# EAGLE schematic l1_pcb_v38 (EAGLE 9.7.0)

## Sheet 1 of 5
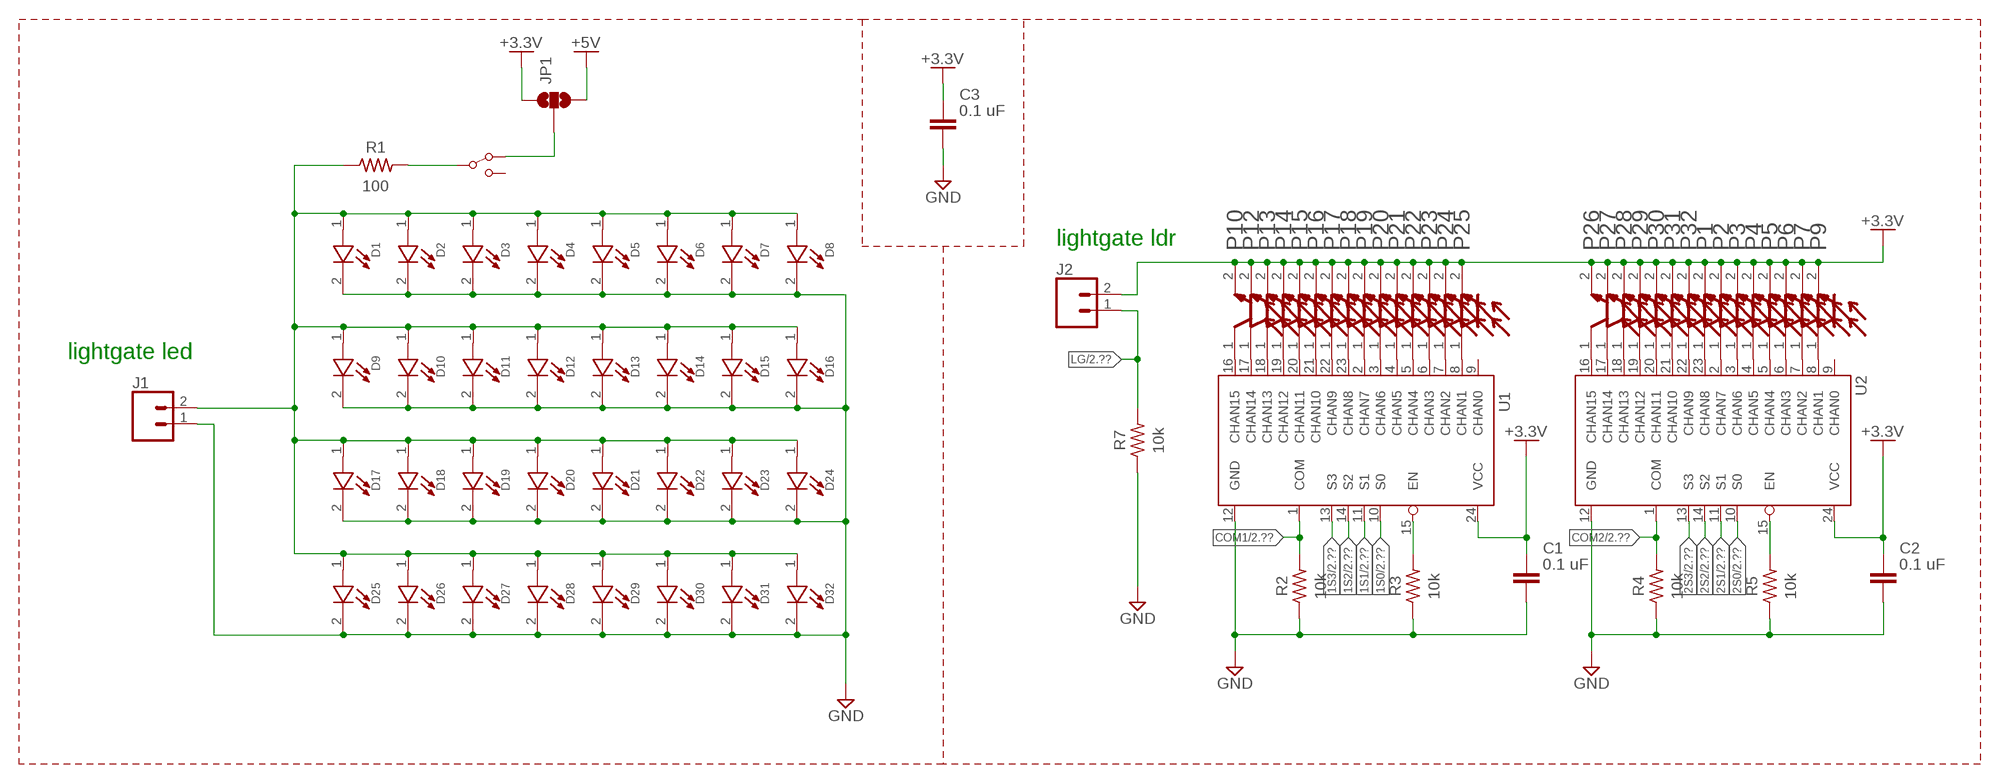
[diagram p0: schematic, sheet 1]

### Parts
C1  0.1 uF  C_CHIP-0603(1608-METRIC)  [CAPC1608X85]
C2  0.1 uF  C_CHIP-0603(1608-METRIC)  [CAPC1608X85]
C3  0.1 uF  C_CHIP-0603(1608-METRIC)  [CAPC1608X85]
D1  OF-SMD3528WCLED  [LED]
D2  OF-SMD3528WCLED  [LED]
D3  OF-SMD3528WCLED  [LED]
D4  OF-SMD3528WCLED  [LED]
D5  OF-SMD3528WCLED  [LED]
D6  OF-SMD3528WCLED  [LED]
D7  OF-SMD3528WCLED  [LED]
D8  OF-SMD3528WCLED  [LED]
D9  OF-SMD3528WCLED  [LED]
D10  OF-SMD3528WCLED  [LED]
D11  OF-SMD3528WCLED  [LED]
D12  OF-SMD3528WCLED  [LED]
D13  OF-SMD3528WCLED  [LED]
D14  OF-SMD3528WCLED  [LED]
D15  OF-SMD3528WCLED  [LED]
D16  OF-SMD3528WCLED  [LED]
D17  OF-SMD3528WCLED  [LED]
D18  OF-SMD3528WCLED  [LED]
D19  OF-SMD3528WCLED  [LED]
D20  OF-SMD3528WCLED  [LED]
D21  OF-SMD3528WCLED  [LED]
D22  OF-SMD3528WCLED  [LED]
D23  OF-SMD3528WCLED  [LED]
D24  OF-SMD3528WCLED  [LED]
D25  OF-SMD3528WCLED  [LED]
D26  OF-SMD3528WCLED  [LED]
D27  OF-SMD3528WCLED  [LED]
D28  OF-SMD3528WCLED  [LED]
D29  OF-SMD3528WCLED  [LED]
D30  OF-SMD3528WCLED  [LED]
D31  OF-SMD3528WCLED  [LED]
D32  OF-SMD3528WCLED  [LED]
J1  CONN_02  [1X02]
J2  CONN_02  [1X02]
JP1  JUMPER-SMT_3_NO_SILK  [SMT-JUMPER_3_NO_SILK]
P1  EVERLIGHT_ALS-PT19-315C-L177-TR8  [ALS-PT19]
P2  EVERLIGHT_ALS-PT19-315C-L177-TR8  [ALS-PT19]
P3  EVERLIGHT_ALS-PT19-315C-L177-TR8  [ALS-PT19]
P4  EVERLIGHT_ALS-PT19-315C-L177-TR8  [ALS-PT19]
P5  EVERLIGHT_ALS-PT19-315C-L177-TR8  [ALS-PT19]
P6  EVERLIGHT_ALS-PT19-315C-L177-TR8  [ALS-PT19]
P7  EVERLIGHT_ALS-PT19-315C-L177-TR8  [ALS-PT19]
P9  EVERLIGHT_ALS-PT19-315C-L177-TR8  [ALS-PT19]
P10  EVERLIGHT_ALS-PT19-315C-L177-TR8  [ALS-PT19]
P12  EVERLIGHT_ALS-PT19-315C-L177-TR8  [ALS-PT19]
P13  EVERLIGHT_ALS-PT19-315C-L177-TR8  [ALS-PT19]
P14  EVERLIGHT_ALS-PT19-315C-L177-TR8  [ALS-PT19]
P15  EVERLIGHT_ALS-PT19-315C-L177-TR8  [ALS-PT19]
P16  EVERLIGHT_ALS-PT19-315C-L177-TR8  [ALS-PT19]
P17  EVERLIGHT_ALS-PT19-315C-L177-TR8  [ALS-PT19]
P18  EVERLIGHT_ALS-PT19-315C-L177-TR8  [ALS-PT19]
P19  EVERLIGHT_ALS-PT19-315C-L177-TR8  [ALS-PT19]
P20  EVERLIGHT_ALS-PT19-315C-L177-TR8  [ALS-PT19]
P21  EVERLIGHT_ALS-PT19-315C-L177-TR8  [ALS-PT19]
P22  EVERLIGHT_ALS-PT19-315C-L177-TR8  [ALS-PT19]
P23  EVERLIGHT_ALS-PT19-315C-L177-TR8  [ALS-PT19]
P24  EVERLIGHT_ALS-PT19-315C-L177-TR8  [ALS-PT19]
P25  EVERLIGHT_ALS-PT19-315C-L177-TR8  [ALS-PT19]
P26  EVERLIGHT_ALS-PT19-315C-L177-TR8  [ALS-PT19]
P27  EVERLIGHT_ALS-PT19-315C-L177-TR8  [ALS-PT19]
P28  EVERLIGHT_ALS-PT19-315C-L177-TR8  [ALS-PT19]
P29  EVERLIGHT_ALS-PT19-315C-L177-TR8  [ALS-PT19]
P30  EVERLIGHT_ALS-PT19-315C-L177-TR8  [ALS-PT19]
P31  EVERLIGHT_ALS-PT19-315C-L177-TR8  [ALS-PT19]
P32  EVERLIGHT_ALS-PT19-315C-L177-TR8  [ALS-PT19]
R1  100  R-US_CHIP-0603(1608-METRIC)  [RESC1608X60]
R2  10k  R-US_CHIP-0603(1608-METRIC)  [RESC1608X60]
R3  10k  R-US_CHIP-0603(1608-METRIC)  [RESC1608X60]
R4  10k  R-US_CHIP-0603(1608-METRIC)  [RESC1608X60]
R5  10k  R-US_CHIP-0603(1608-METRIC)  [RESC1608X60]
R7  10k  R-US_CHIP-0603(1608-METRIC)  [RESC1608X60]
S1  SPDT-SLIDE-SWITCHSWITCH-TH  [SWITCH-TH]
U1  74HC4067SM96  [SSOP24]
U2  74HC4067SM96  [SSOP24]

### Nets
1S0: U1.10(S0) ; also sheet 2
1S1: U1.11(S1) ; also sheet 2
1S2: U1.14(S2) ; also sheet 2
1S3: U1.13(S3) ; also sheet 2
2S0: U2.10(S0) ; also sheet 2
2S1: U2.11(S1) ; also sheet 2
2S2: U2.14(S2) ; also sheet 2
2S3: U2.13(S3) ; also sheet 2
+3.3V: C1.1 C2.1 C3.1 J2.2 JP1.1 P1.2(EMITTER) P2.2(EMITTER) P3.2(EMITTER) P4.2(EMITTER) P5.2(EMITTER) P6.2(EMITTER) P7.2(EMITTER) P9.2(EMITTER) P10.2(EMITTER) P12.2(EMITTER) P13.2(EMITTER) P14.2(EMITTER) P15.2(EMITTER) P16.2(EMITTER) P17.2(EMITTER) P18.2(EMITTER) P19.2(EMITTER) P20.2(EMITTER) P21.2(EMITTER) P22.2(EMITTER) P23.2(EMITTER) P24.2(EMITTER) P25.2(EMITTER) P26.2(EMITTER) P27.2(EMITTER) P28.2(EMITTER) P29.2(EMITTER) P30.2(EMITTER) P31.2(EMITTER) P32.2(EMITTER) U1.24(VCC) U2.24(VCC) ; also sheet 2,3,4,5
+5V: JP1.3 ; also sheet 4,5
COM1: R2.2 U1.1(COM) ; also sheet 2
COM2: R4.2 U2.1(COM) ; also sheet 2
GND: C1.2 C2.2 C3.2 D1.2(C) D2.2(C) D3.2(C) D4.2(C) D5.2(C) D6.2(C) D7.2(C) D8.2(C) D9.2(C) D10.2(C) D11.2(C) D12.2(C) D13.2(C) D14.2(C) D15.2(C) D16.2(C) D17.2(C) D18.2(C) D19.2(C) D20.2(C) D21.2(C) D22.2(C) D23.2(C) D24.2(C) D25.2(C) D26.2(C) D27.2(C) D28.2(C) D29.2(C) D30.2(C) D31.2(C) D32.2(C) J1.1 R2.1 R3.1 R4.1 R5.1 R7.1 U1.12(GND) U2.12(GND) ; also sheet 2,3,4,5
LG: J2.1 R7.2 ; also sheet 2,5
N$1: JP1.2 S1.P$1
N$2: R3.2 U1.15(EN)
N$8: D1.1(A) D2.1(A) D3.1(A) D4.1(A) D5.1(A) D6.1(A) D7.1(A) D8.1(A) D9.1(A) D10.1(A) D11.1(A) D12.1(A) D13.1(A) D14.1(A) D15.1(A) D16.1(A) D17.1(A) D18.1(A) D19.1(A) D20.1(A) D21.1(A) D22.1(A) D23.1(A) D24.1(A) D25.1(A) D26.1(A) D27.1(A) D28.1(A) D29.1(A) D30.1(A) D31.1(A) D32.1(A) J1.2 R1.1
N$9: R5.2 U2.15(EN)
N$10: R1.2 S1.P$2
N$12: P25.1(COLLECTOR) U1.8(CHAN1)
N$13: P17.1(COLLECTOR) U1.22(CHAN9)
N$14: P18.1(COLLECTOR) U1.23(CHAN8)
N$16: P19.1(COLLECTOR) U1.2(CHAN7)
N$17: P20.1(COLLECTOR) U1.3(CHAN6)
N$18: P21.1(COLLECTOR) U1.4(CHAN5)
N$19: P22.1(COLLECTOR) U1.5(CHAN4)
N$21: P23.1(COLLECTOR) U1.6(CHAN3)
N$22: P24.1(COLLECTOR) U1.7(CHAN2)
N$23: P10.1(COLLECTOR) U1.16(CHAN15)
N$24: P12.1(COLLECTOR) U1.17(CHAN14)
N$25: P13.1(COLLECTOR) U1.18(CHAN13)
N$26: P14.1(COLLECTOR) U1.19(CHAN12)
N$27: P15.1(COLLECTOR) U1.20(CHAN11)
N$28: P16.1(COLLECTOR) U1.21(CHAN10)
N$29: P9.1(COLLECTOR) U2.8(CHAN1)
N$30: P1.1(COLLECTOR) U2.23(CHAN8)
N$31: P2.1(COLLECTOR) U2.2(CHAN7)
N$32: P3.1(COLLECTOR) U2.3(CHAN6)
N$33: P4.1(COLLECTOR) U2.4(CHAN5)
N$34: P5.1(COLLECTOR) U2.5(CHAN4)
N$35: P6.1(COLLECTOR) U2.6(CHAN3)
N$36: P7.1(COLLECTOR) U2.7(CHAN2)
N$37: P26.1(COLLECTOR) U2.16(CHAN15)
N$38: P27.1(COLLECTOR) U2.17(CHAN14)
N$39: P28.1(COLLECTOR) U2.18(CHAN13)
N$40: P29.1(COLLECTOR) U2.19(CHAN12)
N$41: P30.1(COLLECTOR) U2.20(CHAN11)
N$42: P31.1(COLLECTOR) U2.21(CHAN10)
N$43: P32.1(COLLECTOR) U2.22(CHAN9)
Unconnected: S1.P$3 U1.9(CHAN0) U2.9(CHAN0)

### Notes on the sheet
- lightgate ldr
- lightgate led

## Sheet 2 of 5
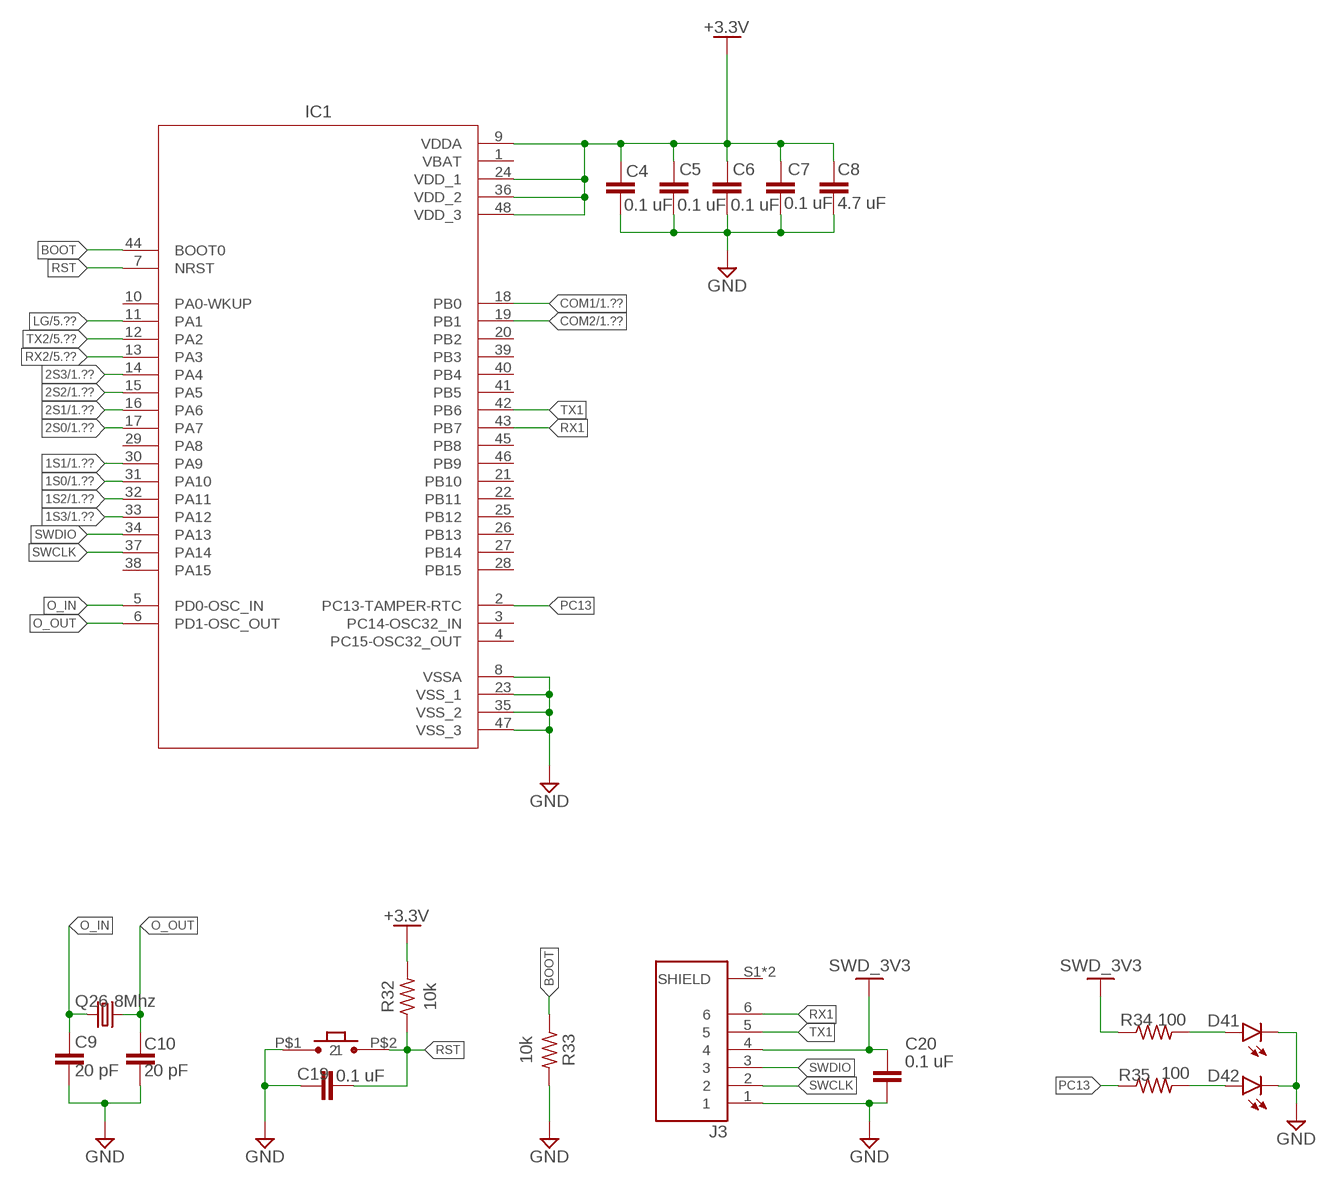
[diagram p1: schematic, sheet 2]

### Parts
C4  0.1 uF  C_CHIP-0603(1608-METRIC)  [CAPC1608X85]
C5  0.1 uF  C_CHIP-0603(1608-METRIC)  [CAPC1608X85]
C6  0.1 uF  C_CHIP-0603(1608-METRIC)  [CAPC1608X85]
C7  0.1 uF  C_CHIP-0603(1608-METRIC)  [CAPC1608X85]
C8  4.7 uF  C_CHIP-0603(1608-METRIC)  [CAPC1608X85]
C9  20 pF  C_CHIP-0603(1608-METRIC)  [CAPC1608X85]
C10  20 pF  C_CHIP-0603(1608-METRIC)  [CAPC1608X85]
C19  0.1 uF  C_CHIP-0603(1608-METRIC)  [CAPC1608X85]
C20  0.1 uF  C_CHIP-0603(1608-METRIC)  [CAPC1608X85]
D41  CHIP-FLAT-G_0603-0.35MM  [LEDC1608X35N_FLAT-G]
D42  CHIP-FLAT-G_0603-0.35MM  [LEDC1608X35N_FLAT-G]
IC1  STM32F103_QFP  [QFP50P900X900X160-48N]
J3  SM06B-SRSS-TB(LF)(SN)  [JST_SM06B-SRSS-TB(LF)(SN)]
Q26  8Mhz  CRYSTALCTS406  [CTS406]
R32  10k  R-US_CHIP-0603(1608-METRIC)  [RESC1608X60]
R33  10k  R-US_CHIP-0603(1608-METRIC)  [RESC1608X60]
R34  100  R-US_CHIP-0603(1608-METRIC)  [RESC1608X60]
R35  100  R-US_CHIP-0603(1608-METRIC)  [RESC1608X60]
U$1  SMOL_TACTILE_3X4MM  [SMOL_TACTILE_3X4MM]

### Nets
1S0: IC1.31(PA10) ; also sheet 1
1S1: IC1.30(PA9) ; also sheet 1
1S2: IC1.32(PA11) ; also sheet 1
1S3: IC1.33(PA12) ; also sheet 1
2S0: IC1.17(PA7) ; also sheet 1
2S1: IC1.16(PA6) ; also sheet 1
2S2: IC1.15(PA5) ; also sheet 1
2S3: IC1.14(PA4) ; also sheet 1
+3.3V: C4.1 C5.1 C6.1 C7.1 C8.1 IC1.9(VDDA) IC1.24(VDD_1) IC1.36(VDD_2) IC1.48(VDD_3) R32.2 ; also sheet 1,3,4,5
BOOT: IC1.44(BOOT0) R33.1
COM1: IC1.18(PB0) ; also sheet 1
COM2: IC1.19(PB1) ; also sheet 1
GND: C4.2 C5.2 C6.2 C7.2 C8.2 C9.2 C10.2 C19.1 C20.2 D41.C D42.C IC1.8(VSSA) IC1.23(VSS_1) IC1.35(VSS_2) IC1.47(VSS_3) J3.1 R33.2 U$1.P$1 ; also sheet 1,3,4,5
LG: IC1.11(PA1) ; also sheet 1,5
N$46: D41.A R34.2
N$52: D42.A R35.2
O_IN: C9.1 IC1.5(PD0-OSC_IN) Q26.1
O_OUT: C10.1 IC1.6(PD1-OSC_OUT) Q26.3
PC13: IC1.2(PC13-TAMPER-RTC) R35.1
RST: C19.2 IC1.7(NRST) R32.1 U$1.P$2
RX1: IC1.43(PB7) J3.6
RX2: IC1.13(PA3) ; also sheet 5
SWCLK: IC1.37(PA14) J3.2
SWD_3V3: C20.1 J3.4 R34.1
SWDIO: IC1.34(PA13) J3.3
TX1: IC1.42(PB6) J3.5
TX2: IC1.12(PA2) ; also sheet 5
Unconnected: IC1.3(PC14-OSC32_IN) IC1.4(PC15-OSC32_OUT) IC1.10(PA0-WKUP) IC1.20(PB2) IC1.21(PB10) IC1.22(PB11) IC1.25(PB12) IC1.26(PB13) IC1.27(PB14) IC1.28(PB15) IC1.29(PA8) IC1.38(PA15) IC1.39(PB3) IC1.40(PB4) IC1.41(PB5) IC1.45(PB8) IC1.46(PB9) J3.S1(SHIELD) J3.S2(SHIELD)

## Sheet 3 of 5
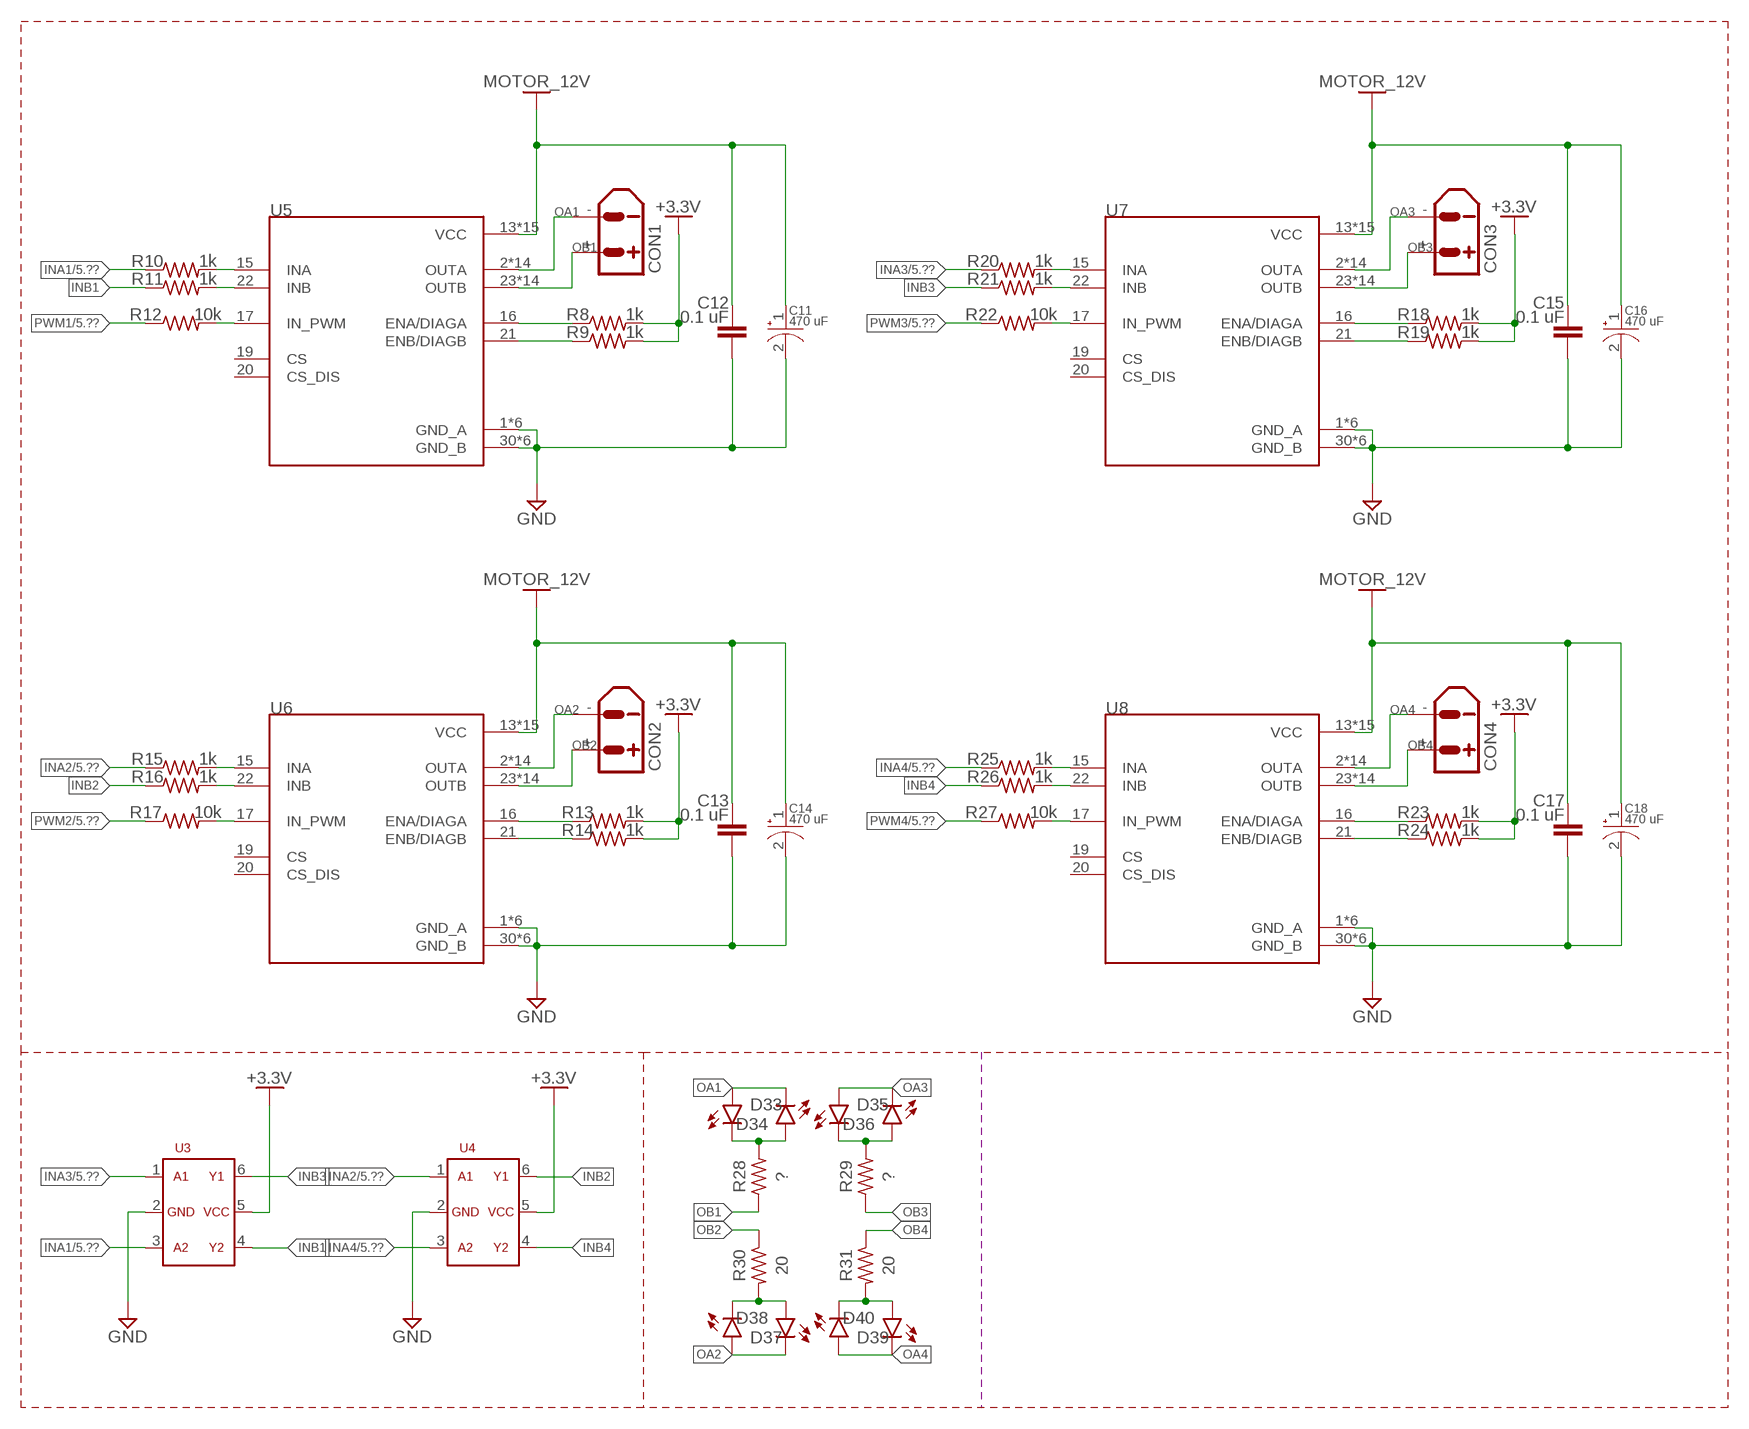
[diagram p2: schematic, sheet 3]

### Parts
C11  470 uF  47UF  [6.3_X_7.7]
C12  0.1 uF  C_CHIP-0603(1608-METRIC)  [CAPC1608X85]
C13  0.1 uF  C_CHIP-0603(1608-METRIC)  [CAPC1608X85]
C14  470 uF  47UF  [6.3_X_7.7]
C15  0.1 uF  C_CHIP-0603(1608-METRIC)  [CAPC1608X85]
C16  470 uF  47UF  [6.3_X_7.7]
C17  0.1 uF  C_CHIP-0603(1608-METRIC)  [CAPC1608X85]
C18  470 uF  47UF  [6.3_X_7.7]
CON1  XT30UPB-M  [XT30UPB-M]
CON2  XT30UPB-M  [XT30UPB-M]
CON3  XT30UPB-M  [XT30UPB-M]
CON4  XT30UPB-M  [XT30UPB-M]
D33  CHIP-FLAT-G_0603-0.35MM  [LEDC1608X35N_FLAT-G]
D34  CHIP-FLAT-G_0603-0.35MM  [LEDC1608X35N_FLAT-G]
D35  CHIP-FLAT-G_0603-0.35MM  [LEDC1608X35N_FLAT-G]
D36  CHIP-FLAT-G_0603-0.35MM  [LEDC1608X35N_FLAT-G]
D37  CHIP-FLAT-G_0603-0.35MM  [LEDC1608X35N_FLAT-G]
D38  CHIP-FLAT-G_0603-0.35MM  [LEDC1608X35N_FLAT-G]
D39  CHIP-FLAT-G_0603-0.35MM  [LEDC1608X35N_FLAT-G]
D40  CHIP-FLAT-G_0603-0.35MM  [LEDC1608X35N_FLAT-G]
R8  1k  R-US_CHIP-0603(1608-METRIC)  [RESC1608X60]
R9  1k  R-US_CHIP-0603(1608-METRIC)  [RESC1608X60]
R10  1k  R-US_CHIP-0603(1608-METRIC)  [RESC1608X60]
R11  1k  R-US_CHIP-0603(1608-METRIC)  [RESC1608X60]
R12  10k  R-US_CHIP-0603(1608-METRIC)  [RESC1608X60]
R13  1k  R-US_CHIP-0603(1608-METRIC)  [RESC1608X60]
R14  1k  R-US_CHIP-0603(1608-METRIC)  [RESC1608X60]
R15  1k  R-US_CHIP-0603(1608-METRIC)  [RESC1608X60]
R16  1k  R-US_CHIP-0603(1608-METRIC)  [RESC1608X60]
R17  10k  R-US_CHIP-0603(1608-METRIC)  [RESC1608X60]
R18  1k  R-US_CHIP-0603(1608-METRIC)  [RESC1608X60]
R19  1k  R-US_CHIP-0603(1608-METRIC)  [RESC1608X60]
R20  1k  R-US_CHIP-0603(1608-METRIC)  [RESC1608X60]
R21  1k  R-US_CHIP-0603(1608-METRIC)  [RESC1608X60]
R22  10k  R-US_CHIP-0603(1608-METRIC)  [RESC1608X60]
R23  1k  R-US_CHIP-0603(1608-METRIC)  [RESC1608X60]
R24  1k  R-US_CHIP-0603(1608-METRIC)  [RESC1608X60]
R25  1k  R-US_CHIP-0603(1608-METRIC)  [RESC1608X60]
R26  1k  R-US_CHIP-0603(1608-METRIC)  [RESC1608X60]
R27  10k  R-US_CHIP-0603(1608-METRIC)  [RESC1608X60]
R28  ?  R-US_CHIP-0603(1608-METRIC)  [RESC1608X60]
R29  ?  R-US_CHIP-0603(1608-METRIC)  [RESC1608X60]
R30  20  R-US_CHIP-0603(1608-METRIC)  [RESC1608X60]
R31  20  R-US_CHIP-0603(1608-METRIC)  [RESC1608X60]
U3  SN74LVC2G04DBVR  [SOT23-6]
U4  SN74LVC2G04DBVR  [SOT23-6]
U5  VNH5050A-E  [SOP50P1030X247-39N]
U6  VNH5050A-E  [SOP50P1030X247-39N]
U7  VNH5050A-E  [SOP50P1030X247-39N]
U8  VNH5050A-E  [SOP50P1030X247-39N]

### Nets
+3.3V: R8.2 R9.2 R13.2 R14.2 R18.2 R19.2 R23.2 R24.2 U3.5 U4.5 ; also sheet 1,2,4,5
GND: C11.2 C12.2 C13.2 C14.2 C15.2 C16.2 C17.2 C18.2 U3.2 U4.2 U5.1(GND_A) U5.3(GND_A) U5.4(GND_A) U5.5(GND_A) U5.6(GND_A) U5.7(GND_A) U5.30(GND_B) U5.31(GND_B) U5.32(GND_B) U5.33(GND_B) U5.34(GND_B) U5.36(GND_B) U6.1(GND_A) U6.3(GND_A) U6.4(GND_A) U6.5(GND_A) U6.6(GND_A) U6.7(GND_A) U6.30(GND_B) U6.31(GND_B) U6.32(GND_B) U6.33(GND_B) U6.34(GND_B) U6.36(GND_B) U7.1(GND_A) U7.3(GND_A) U7.4(GND_A) U7.5(GND_A) U7.6(GND_A) U7.7(GND_A) U7.30(GND_B) U7.31(GND_B) U7.32(GND_B) U7.33(GND_B) U7.34(GND_B) U7.36(GND_B) U8.1(GND_A) U8.3(GND_A) U8.4(GND_A) U8.5(GND_A) U8.6(GND_A) U8.7(GND_A) U8.30(GND_B) U8.31(GND_B) U8.32(GND_B) U8.33(GND_B) U8.34(GND_B) U8.36(GND_B) ; also sheet 1,2,4,5
INA1: R10.1 U3.3 ; also sheet 5
INA2: R15.1 U4.1 ; also sheet 5
INA3: R20.1 U3.1 ; also sheet 5
INA4: R25.1 U4.3 ; also sheet 5
INB1: R11.1 U3.4
INB2: R16.1 U4.6
INB3: R21.1 U3.6
INB4: R26.1 U4.4
MOTOR_12V: C11.1 C12.1 C13.1 C14.1 C15.1 C16.1 C17.1 C18.1 U5.13(VCC) U5.24(VCC) U5.39(VCC) U5.39_1(VCC) U5.39_2(VCC) U5.39_3(VCC) U5.39_4(VCC) U5.39_5(VCC) U5.39_6(VCC) U5.39_7(VCC) U5.39_8(VCC) U5.39_9(VCC) U5.39_10(VCC) U5.39_11(VCC) U5.39_12(VCC) U6.13(VCC) U6.24(VCC) U6.39(VCC) U6.39_1(VCC) U6.39_2(VCC) U6.39_3(VCC) U6.39_4(VCC) U6.39_5(VCC) U6.39_6(VCC) U6.39_7(VCC) U6.39_8(VCC) U6.39_9(VCC) U6.39_10(VCC) U6.39_11(VCC) U6.39_12(VCC) U7.13(VCC) U7.24(VCC) U7.39(VCC) U7.39_1(VCC) U7.39_2(VCC) U7.39_3(VCC) U7.39_4(VCC) U7.39_5(VCC) U7.39_6(VCC) U7.39_7(VCC) U7.39_8(VCC) U7.39_9(VCC) U7.39_10(VCC) U7.39_11(VCC) U7.39_12(VCC) U8.13(VCC) U8.24(VCC) U8.39(VCC) U8.39_1(VCC) U8.39_2(VCC) U8.39_3(VCC) U8.39_4(VCC) U8.39_5(VCC) U8.39_6(VCC) U8.39_7(VCC) U8.39_8(VCC) U8.39_9(VCC) U8.39_10(VCC) U8.39_11(VCC) U8.39_12(VCC) ; also sheet 5
N$3: R10.2 U5.15(INA)
N$4: R11.2 U5.22(INB)
N$5: R12.2 U5.17(IN_PWM)
N$6: R8.1 U5.16(ENA/DIAGA)
N$7: R9.1 U5.21(ENB/DIAGB)
N$11: D35.C D36.A R29.2
N$15: D33.C D34.A R28.2
N$47: R15.2 U6.15(INA)
N$48: R16.2 U6.22(INB)
N$49: R17.2 U6.17(IN_PWM)
N$50: R13.1 U6.16(ENA/DIAGA)
N$51: R14.1 U6.21(ENB/DIAGB)
N$54: D37.C D38.A R30.2
N$57: R20.2 U7.15(INA)
N$59: R21.2 U7.22(INB)
N$60: R22.2 U7.17(IN_PWM)
N$61: R18.1 U7.16(ENA/DIAGA)
N$62: R19.1 U7.21(ENB/DIAGB)
N$63: D39.C D40.A R31.2
N$68: R25.2 U8.15(INA)
N$69: R26.2 U8.22(INB)
N$70: R27.2 U8.17(IN_PWM)
N$71: R23.1 U8.16(ENA/DIAGA)
N$72: R24.1 U8.21(ENB/DIAGB)
OA1: CON1.- D33.A D34.C U5.2(OUTA) U5.8(OUTA) U5.9(OUTA) U5.10(OUTA) U5.11(OUTA) U5.12(OUTA) U5.14(OUTA) U5.38(OUTA) U5.38_1(OUTA) U5.38_2(OUTA) U5.38_3(OUTA) U5.38_4(OUTA) U5.38_5(OUTA) U5.38_6(OUTA)
OA2: CON2.- D37.A D38.C U6.2(OUTA) U6.8(OUTA) U6.9(OUTA) U6.10(OUTA) U6.11(OUTA) U6.12(OUTA) U6.14(OUTA) U6.38(OUTA) U6.38_1(OUTA) U6.38_2(OUTA) U6.38_3(OUTA) U6.38_4(OUTA) U6.38_5(OUTA) U6.38_6(OUTA)
OA3: CON3.- D35.A D36.C U7.2(OUTA) U7.8(OUTA) U7.9(OUTA) U7.10(OUTA) U7.11(OUTA) U7.12(OUTA) U7.14(OUTA) U7.38(OUTA) U7.38_1(OUTA) U7.38_2(OUTA) U7.38_3(OUTA) U7.38_4(OUTA) U7.38_5(OUTA) U7.38_6(OUTA)
OA4: CON4.- D39.A D40.C U8.2(OUTA) U8.8(OUTA) U8.9(OUTA) U8.10(OUTA) U8.11(OUTA) U8.12(OUTA) U8.14(OUTA) U8.38(OUTA) U8.38_1(OUTA) U8.38_2(OUTA) U8.38_3(OUTA) U8.38_4(OUTA) U8.38_5(OUTA) U8.38_6(OUTA)
OB1: CON1.+ R28.1 U5.23(OUTB) U5.25(OUTB) U5.26(OUTB) U5.27(OUTB) U5.28(OUTB) U5.29(OUTB) U5.35(OUTB) U5.37(OUTB) U5.37_1(OUTB) U5.37_2(OUTB) U5.37_3(OUTB) U5.37_4(OUTB) U5.37_5(OUTB) U5.37_6(OUTB)
OB2: CON2.+ R30.1 U6.23(OUTB) U6.25(OUTB) U6.26(OUTB) U6.27(OUTB) U6.28(OUTB) U6.29(OUTB) U6.35(OUTB) U6.37(OUTB) U6.37_1(OUTB) U6.37_2(OUTB) U6.37_3(OUTB) U6.37_4(OUTB) U6.37_5(OUTB) U6.37_6(OUTB)
OB3: CON3.+ R29.1 U7.23(OUTB) U7.25(OUTB) U7.26(OUTB) U7.27(OUTB) U7.28(OUTB) U7.29(OUTB) U7.35(OUTB) U7.37(OUTB) U7.37_1(OUTB) U7.37_2(OUTB) U7.37_3(OUTB) U7.37_4(OUTB) U7.37_5(OUTB) U7.37_6(OUTB)
OB4: CON4.+ R31.1 U8.23(OUTB) U8.25(OUTB) U8.26(OUTB) U8.27(OUTB) U8.28(OUTB) U8.29(OUTB) U8.35(OUTB) U8.37(OUTB) U8.37_1(OUTB) U8.37_2(OUTB) U8.37_3(OUTB) U8.37_4(OUTB) U8.37_5(OUTB) U8.37_6(OUTB)
PWM1: R12.1 ; also sheet 5
PWM2: R17.1 ; also sheet 5
PWM3: R22.1 ; also sheet 5
PWM4: R27.1 ; also sheet 5
Unconnected: U5.19(CS) U5.20(CS_DIS) U6.19(CS) U6.20(CS_DIS) U7.19(CS) U7.20(CS_DIS) U8.19(CS) U8.20(CS_DIS)

## Sheet 4 of 5
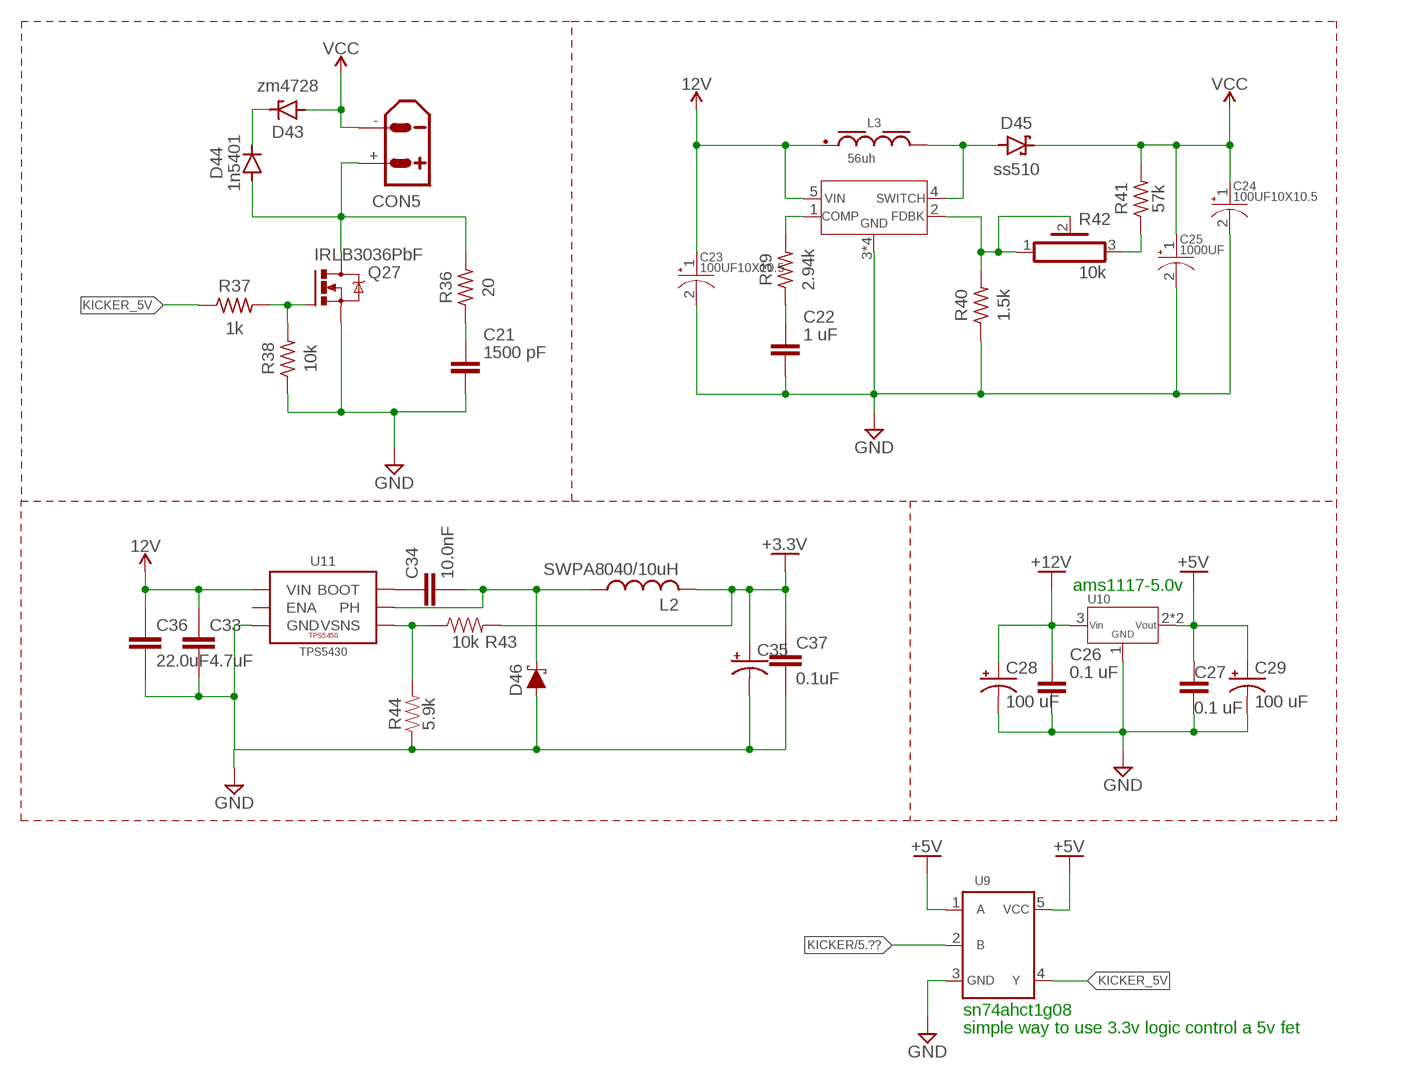
[diagram p3: schematic, sheet 4]

### Parts
C21  1500 pF  C_CHIP-0603(1608-METRIC)  [CAPC1608X85]
C22  1 uF  C_CHIP-0603(1608-METRIC)  [CAPC1608X85]
C23  100UF10X10.5  [10_X_10.5]
C24  100UF10X10.5  [10_X_10.5]
C25  1000UF  [16_X_25]
C26  0.1 uF  C_CHIP-0603(1608-METRIC)  [CAPC1608X85]
C27  0.1 uF  C_CHIP-0603(1608-METRIC)  [CAPC1608X85]
C28  100 uF  C-POL-US_TANTALUM-2917(7343-METRIC)  [CAPMP7343X310N]
C29  100 uF  C-POL-US_TANTALUM-2917(7343-METRIC)  [CAPMP7343X310N]
C33  4.7uF  CAPACITOR0603  [C0603]
C34  10.0nF  CAPACITOR0603  [C0603]
C35  220uF  CPOL-USD/7343-31R  [D/7343-31R]
C36  22.0uF  CAPACITOR1210  [C1210]
C37  0.1uF  CAPACITOR0603  [C0603]
CON5  XT30UPB-F  [XT30UPB-F]
D43  zm4728  ZENER_DO-213AB(5025-METRIC)  [DIOMELF5024]
D44  1n5401  DIODEDO-201AD  [DO-201AD]
D45  ss510  SCHOTTKY_  [DIOM5226X290N]
D46  3A/40V/500mV  DIODE-SCHOTTKY-B340A  [SMA-DIODE]
L2  SWPA8040/10uH  INDUCTORSWPA8040  [SWPA8040]
L3  56uh  WE-PD_7345R_7447779001  [WE-PD_7345R]
Q27  IRLB3036PbF  NMOSFET_TO220  [TO220BV]
R36  20  R-US_AXIAL-7.2MM-PITCH  [RESAD724W46L381D178B]
R37  1k  R-US_CHIP-0603(1608-METRIC)  [RESC1608X60]
R38  10k  R-US_CHIP-0603(1608-METRIC)  [RESC1608X60]
R39  2.94k  R-US_CHIP-0603(1608-METRIC)  [RESC1608X60]
R40  1.5k  R-US_CHIP-0603(1608-METRIC)  [RESC1608X60]
R41  57k  R-US_CHIP-0603(1608-METRIC)  [RESC1608X60]
R42  10k  PV36X  [PV36X]
R43  10k  RESISTOR0603  [R0603]
R44  5.9k  RESISTOR0603  [R0603]
U9  SN74AHCT1G08  [SOT23-5]
U10  AMS1117-5.0  [SOT223]
U11  TPS5430  TPS5450  [POWERPAD-SOIC-8]
U$5  LM2587  [TO263-5]

### Nets
12V: C23.1 C33.1 C36.1 L3.1 U11.7(VIN) U$5.5 ; also sheet 5
+3.3V: C35.+ C37.1 L2.P2 R43.2 ; also sheet 1,2,3,5
+5V: C27.1 C29.1(+) U9.1 U9.5 U10.2 U10.4 ; also sheet 1,5
+12V: C26.1 C28.1(+) U10.3
GND: C21.2 C22.2 C23.2 C24.2 C25.2 C26.2 C27.2 C28.2(-) C29.2(-) C33.2 C35.- C36.2 C37.2 D46.A Q27.S R38.1 R40.1 R44.1 U9.3 U10.1 U11.6(GND) U11.9(GND) U11.P$1(GND) U11.P$2(GND) U11.P$3(GND) U11.P$4(GND) U11.P$5(GND) U11.P$6(GND) U$5.3 U$5.6 U$5.P$1 U$5.P$2 ; also sheet 1,2,3,5
KICKER: U9.2 ; also sheet 5
KICKER_5V: R37.1 U9.4
N$45: C34.2 D46.C L2.P1 U11.8(PH)
N$56: CON5.+ D44.A Q27.D R36.2
N$58: C21.1 R36.1
N$64: D43.1(C) D44.C
N$65: Q27.G R37.2 R38.2
N$66: D45.1(A) L3.2 U$5.4
N$67: R39.2 U$5.1
N$73: C22.1 R39.1
N$74: R41.1 R42.3
N$75: R40.2 R42.1 R42.2 U$5.2
N$96: R43.1 R44.2 U11.4(VSNS)
N$97: C34.1 U11.1(BOOT)
VCC: C24.1 C25.1 CON5.- D43.2(A) D45.2(C) R41.2 ; also sheet 5
Unconnected: U11.2(NC) U11.3(NC) U11.5(ENA)

### Notes on the sheet
- ams1117-5.0v
- sn74ahct1g08
- simple way to use 3.3v logic control a 5v fet

## Sheet 5 of 5
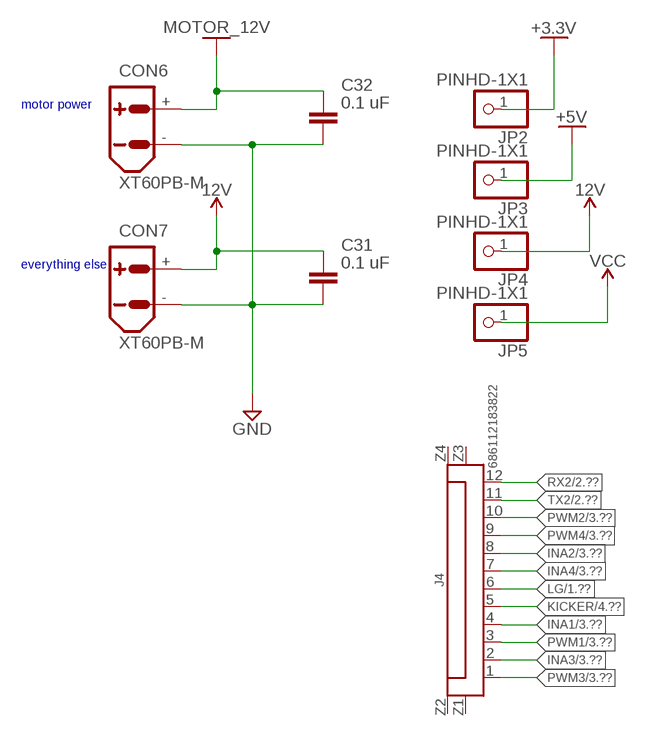
[diagram p4: schematic, sheet 5]

### Parts
C31  0.1 uF  C_CHIP-0603(1608-METRIC)  [CAPC1608X85]
C32  0.1 uF  C_CHIP-0603(1608-METRIC)  [CAPC1608X85]
CON6  XT60PB-M  [XT60PB-M]
CON7  XT60PB-M  [XT60PB-M]
J4  686112183822  6861XX183822_686112183822  [686112183822]
JP2  PINHD-1X1  [1X01]
JP3  PINHD-1X1  [1X01]
JP4  PINHD-1X1  [1X01]
JP5  PINHD-1X1  [1X01]

### Nets
12V: C31.1 CON7.+ JP4.1 ; also sheet 4
+3.3V: JP2.1 ; also sheet 1,2,3,4
+5V: JP3.1 ; also sheet 1,4
GND: C31.2 C32.2 CON6.- CON7.- ; also sheet 1,2,3,4
INA1: J4.4 ; also sheet 3
INA2: J4.8 ; also sheet 3
INA3: J4.2 ; also sheet 3
INA4: J4.7 ; also sheet 3
KICKER: J4.5 ; also sheet 4
LG: J4.6 ; also sheet 1,2
MOTOR_12V: C32.1 CON6.+ ; also sheet 3
PWM1: J4.3 ; also sheet 3
PWM2: J4.10 ; also sheet 3
PWM3: J4.1 ; also sheet 3
PWM4: J4.9 ; also sheet 3
RX2: J4.12 ; also sheet 2
TX2: J4.11 ; also sheet 2
VCC: JP5.1 ; also sheet 4
Unconnected: J4.Z1 J4.Z2 J4.Z3 J4.Z4

### Notes on the sheet
- motor power
- everything else

## Power pins joined to a net without a drawn wire
VBAT: IC1.1(VBAT)

## Library data of the parts
C1-C10 C12 C13 C15 C17 C19-C22 C26 C27 C31 C32 = Capacitor:C: Capacitor - Generic; CATEGORY: Capacitor
C11 C14 C16 C18 = i want to make my own parts:47UF
C23 C24 = i want to make my own parts:100UF
C25 = i want to make my own parts:1000UF
C28 C29 = Capacitor:C-POL-US: Capacitor Polarised - ANSI; CATEGORY: Capacitor
C33 C34 C36 C37 = JH:CAPACITOR
C35 = rcl:CPOL-US: POLARIZED CAPACITOR, American symbol; SPICEPREFIX: C
CON1-CON5 = amass xt series:XT30: AMASS XT30 connector Store in Japan AMASS XT30 connector <https://szc.jp/ams-xt30>
CON6 CON7 = amass xt series:XT60: AMASS XT60 connector Store in Japan AMASS XT60 connector <https://szc.jp/ams-xt60>
D1-D32 = 3528 led:OF-SMD3528WC: LED; SMD; 3528, PLCC2; white cold; 1700-2500mcd; 120°; 2
D33-D42 = LED:CHIP-FLAT-G; CATEGORY: LED; COLOR: GREEN; DESCRIPTION: CHIP LED FLAT; SUB-CATEGORY: CHIP; TYPE: FLAT_TOP; VALUE: LED_GREEN
D43 = Diode:ZENER: Zener Diode - Generic; CATEGORY: Diode; SUB-CATEGORY: Zener; VALUE: ZENER
D44 = diodess:DIODE: Diode Rectifier - Generic
D45 = diodess:SCHOTTKY_: Schottky Diode - Popular parts
D46 = SparkFun-DiscreteSemi:DIODE-SCHOTTKY: Schottky diode A Schottky diode is a semiconductor diode which has a low forward voltage drop and a very fast switching action.; PROD_ID: DIO-09886
IC1 = IC_Embedded:STM32F103: Medium-density performance line ARM®-based 32-bit MCU with 64 or 128 KB Flash, USB, CAN, 7 timers, 2 ADCs, 9 com. interfaces Datasheet <https://www.st.com/resource/en/datasheet/stm32f103c8.pdf>; CATEGORY: IC_Embedded; MANUFACTURER: ST Microelectronics; MPN: STM32F103C6T7A; OPERATING_TEMP: -40 to 105 °C; PART_STATUS: Active; SUB-CATEGORY: Microcontroller; THERMALLOSS: 0.44W; VALUE: STM32F103C6
J1 J2 = SparkFun-Connectors:CONN_02: Multi connection point. Often used as Generic Header-pin footprint for 0.1 inch spaced/style header connections On any of the 0.1 inch spaced packages, you can populate with these: Break Away Headers - Straight <https://www.sparkfun.com/products/116> (PRT-00116) Break Away Male Headers - Right Angle <https://www.sparkfun.com/products/553> (PRT-00553) Female Headers <https://www.sparkfun.com/products/115> (PRT-00115) Break Away Headers - Machine Pin <https://www.sparkfun.com/products/117> (PRT-00117) Break Away Female Headers - Swiss Machine Pin <https://www.sparkfun.com/products/743> (PRT-00743) For SCREWTERMINALS and SPRING TERMINALS visit here: Screw Terimnals on SparkFun.com <https://www.sparkfun.com/search/results?term=Screw+Terminals> (5mm/3.5mm/2.54mm spacing) This device is also useful as a general connection point to wire up your design to another part of your project. Our various solder wires solder well into these plated through hole pads. Hook-Up Wire - Assortment (Stranded, 22 AWG) <https://www.sparkfun.com/products/11375> (PRT-11375) Hook-Up Wire - Assortment (Solid Core, 22 AWG) <https://www.sparkfun.com/products/11367> (PRT-11367) View the entire wire category on our website here <https://www.sparkfun.com/categories/141> Special notes: Molex polarized connector foot print use with: PRT-08233 with associated crimp pins and housings. 2.54_SCREWTERM for use with PRT-10571. 3.5mm Screw Terminal footprints for PRT-08084 5mm Screw Terminal footprints for use with PRT-08432
J3 = SM06B-SRSS-TB_LF__SN_:SM06B-SRSS-TB(LF)(SN): SH Series 6 Position 1 mm Surface Mount Right Angle Side Entry Shrouded Header; MANUFACTURER: JST; STANDARD: Manufacturer Recommendation
J4 = Wurth_Connectors_WR-FPC:6861XX183822_686112183822: WR-FPC 1.00 mm SMT ZIF Vertical Type A KIND PROPERTIES Pitch 1 mm MATERIAL PROPERTIES Insulator Material PA6T Contact Material Phosphor Bronze Contact Plating 120 (µ") Tin over 30 (µ") Nickel Solder Tabs Brass <https://www.we-online.com/catalog/media/o83988v209%20Family_WR-FPC_6861xx183822.jpg> Details see: https://www.we-online.com/catalog/en/FPC_1_00_SMT_ZIF_VERTICAL_TYPE_A_6861XX183822/ Updated by Ella Wu, 2020-08-25 2020 (C) Würth Elektronik; CONTACT-RESISTANCE: 30mOhm; DATASHEET-URL: https://www.we-online.com/catalog/datasheet/686112183822.pdf; IR: 1A; L: 18.8mm; MATE-WITH: WR-FFC 1.00 mm Flat Flexible Cable Type 1 (Contacts on same side)/ Type 2 (Contacts opposite); PACKAGING: Tape and Reel; PART-NUMBER: 686112183822; PINS: 12; PITCH: 1mm; TYPE: Vertical; WORKING-VOLTAGE: 125V(AC)
JP1 = SparkFun-Jumpers:JUMPER-SMT_3_NO: Normally open jumper This jumper has three pads in close proximity to each other. Apply solder to close the connection(s).
JP2-JP5 = Connector:PINHD-1X1: PIN HEADER; CATEGORY: CONNECTOR; SUB-CATEGORY: PIN-HEADER
L2 = JH:INDUCTOR
L3 = Wurth_Power Magnetics_WE-PD:WE-PD_7345R: WE-PD SMT Power Inductor Characteristics AECQ 200 Qualified Ultra low RDC and RAC Highest possible saturation current based on Ferrite Suitable for switching frequency up to 10MHz Temperature dependent parameter available on Redexpert Operating Temperature from -40°C to +125°C / +150°C Types WE-PD: Since always with low loss material, tight tolerances and high saturation behavior compared to other manufacturers in the market WE-PD Robust: Plastic base improves the mechanical stability and efficiency WE-PD Performance: MnZn core improves Saturation and RDC for highest efficiency Applications Switch Mode Power supplies from 0,1W up to 300W Integrated DC DC Converter Ideal for Switch Mode Power supplies with extreme high efficiency (>95%) <https://www.we-online.com/catalog/media/o14825v209%20Family_WE-PD.jpg> Details see: www.we-online.com/catalog/WE-PD <www.we-online.com/catalog/WE-PD/?utm_source=eagle_model&utm_medium=description_link&utm_campaign=eisos_eagle> Updated by Ella Wu 2022-07-27 2022 (C) Wurth Elektronik; DATASHEET-URL: https://www.we-online.com/redexpert/spec/7447779001?ae; FRES: 100MHz; IR: 5.3A; ISAT: 9.5A; MOUNT: SMT; PART-NUMBER: 7447779001; RDC-MAX: 15mohm; RDC-TYP: 10mohm; SIZE: 7345; VALUE: 1uH; VERSION: Robust
P1-P7 P9 P10 P12-P32 = TR8:EVERLIGHT_ALS-PT19-315C-L177-TR8: Ambient Light Sensor
Q26 = crystal:CRYSTAL: CRYSTAL; OC_FARNELL: unknown; OC_NEWARK: unknown
Q27 = Transistor:NMOSFET: N-Channel MOSFET - Generic; CATEGORY: Transistor; SUB-CATEGORY: MOSFET; TYPE: N-Channel; VALUE: NMOSFET
R1-R5 R7-R41 = Resistor:R-US: Resistor Fixed - ANSI; CATEGORY: Resistor; SUB-CATEGORY: Fixed
R42 = Resistor:PV36: Rectangular Trimmer Potentiometers - PV36 Series Datasheet <https://www.bourns.com/docs/Product-Datasheets/pv36.pdf>; CATEGORY: Resistor; DESCRIPTION: Lead Sealed Type Multiturn PV36 Series; MANUFACTURER: BOURNS; MPN: PV36X; OPERATING_TEMPERATURE: -55 to +125 °C; PART_STATUS: Active; ROHS_COMPLIANCE: RoHS Compliant; SERIES: PV36; SUB-CATEGORY: Trimpot; TYPE: Lead sealed
R43 R44 = JH:RESISTOR
S1 = i want to make my own parts:SPDT-SLIDE-SWITCH
U1 U2 = SparkFun-IC-Logic:74*4067: 16-channel analog MUX Datasheet <http://www.sparkfun.com/datasheets/IC/cd74hc4067.pdf> SparkFun Products MP3 Trigger <https://www.sparkfun.com/products/13720> (WIG-13720) SparkFun Analog/Digital MUX Breakout - CD74HC4067 <https://www.sparkfun.com/products/9056> (BOB-09056); PROD_ID: IC-08252; VALUE: CD74HC4067SM96
U3 U4 = i want to make my own parts:SN74LVC2G04DBVR
U5-U8 = VNH5050A-E:VNH5050A-E: VNH5050A-E Series 18 V 30 A Automotive Fully Integrated H-bridge Motor Driver; A1_MIN: 0.0; A_MAX: 2.47; A_MIN: 2.47; A_NOM: 2.47; B_MAX: 0.36; B_MIN: 0.18; B_NOM: 0.27; D2_MAX: 0.0; D_MAX: 10.5; D_MIN: 10.1; D_NOM: 10.3; E1_MAX: 7.6; E1_MIN: 7.4; E1_NOM: 7.5; E2_MAX: 0.0; ENOM: 0.5; E_MAX: 10.5; E_MIN: 10.1; E_NOM: 10.3; L_MAX: 1.0; L_MIN: 0.6; L_NOM: 0.8; MANUFACTURER: ST Microelectronics; PARTREV: 1.0; PIN_COUNT: 36.0; STANDARD: IPC 7351B
U9 = i want to make my own parts:SN74AHCT1G08
U10 = i want to make my own parts:AMS1117-5.0
U11 = JH:TPS5450
U$1 = smolswitch:SMOL_TACTILE_3X4MM
U$5 = i want to make my own parts:LM2587